# Altium schematic sheet Multiband XOver filter.SchDoc
size A4; SheetNumber: 6; SheetTotal: 7
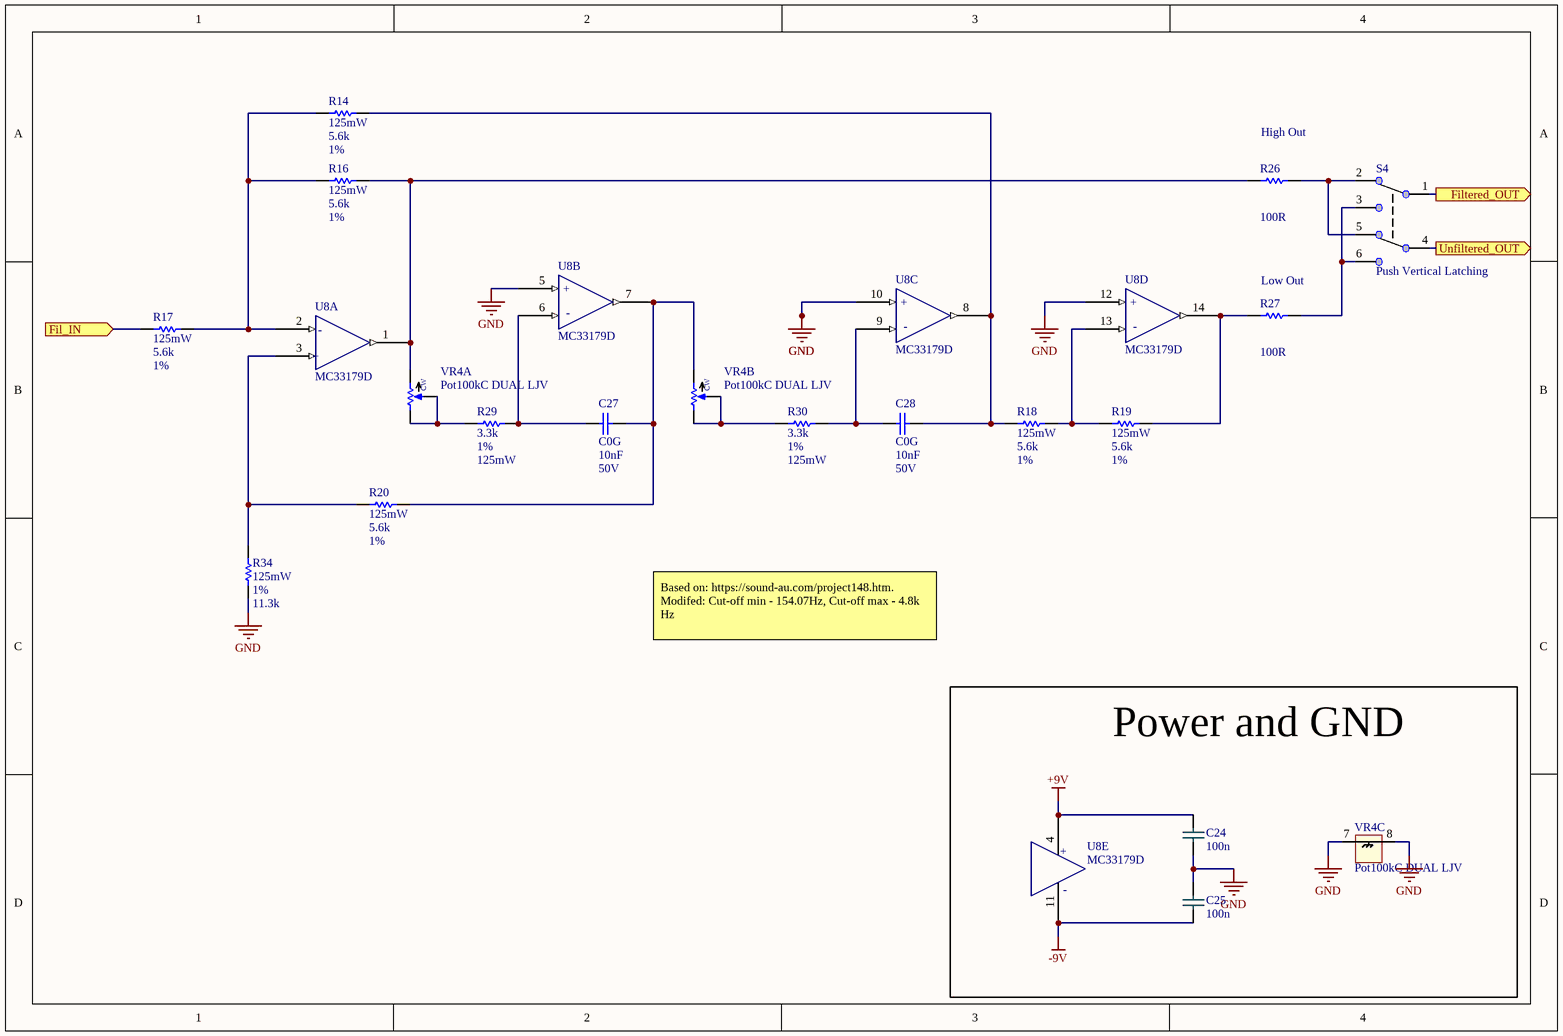
[diagram p0: Multiband XOver filter.SchDoc]

## Parts
C24  value 100n  [0805-CAP]  (hidden comment: Cap 0805 100nF 4)
C25  value 100n  [0805-CAP]  (hidden comment: Cap 0805 100nF 4)
C27  Dielectric: C0G  Capacitance: 10nF  Rated Voltage: 50V  [0805-CAP]  (hidden comment: Cap 10nF 0805 C0G)
C28  Dielectric: C0G  Capacitance: 10nF  Rated Voltage: 50V  [0805-CAP]  (hidden comment: Cap 10nF 0805 C0G)
R14  Power: 125mW  Resistance: 5.6k  Tolerance (+-): 1%  [0805-RES]  (hidden comment: Res 5.6k 1% 0805)
R16  Power: 125mW  Resistance: 5.6k  Tolerance (+-): 1%  [0805-RES]  (hidden comment: Res 5.6k 1% 0805)
R17  Power: 125mW  Resistance: 5.6k  Tolerance (+-): 1%  [0805-RES]  (hidden comment: Res 5.6k 1% 0805)
R18  Power: 125mW  Resistance: 5.6k  Tolerance (+-): 1%  [0805-RES]  (hidden comment: Res 5.6k 1% 0805)
R19  Power: 125mW  Resistance: 5.6k  Tolerance (+-): 1%  [0805-RES]  (hidden comment: Res 5.6k 1% 0805)
R20  Power: 125mW  Resistance: 5.6k  Tolerance (+-): 1%  [0805-RES]  (hidden comment: Res 5.6k 1% 0805)
R26  Resistance: 100R  [0805-RES]  (hidden comment: Res 0805 100R 1%)
R27  Resistance: 100R  [0805-RES]  (hidden comment: Res 0805 100R 1%)
R29  Resistance: 3.3k  Tolerance (+-): 1%  Power: 125mW  [0805-RES]  (hidden comment: Res 3.3k 1% 0805)
R30  Resistance: 3.3k  Tolerance (+-): 1%  Power: 125mW  [0805-RES]  (hidden comment: Res 3.3k 1% 0805)
R34  Power: 125mW  Tolerance (+-): 1%  Resistance: 11.3k  [0805-RES]  (hidden comment: Res 11.3k 1% 0805)
S4  Push Vertical Latching  [PUSH VERTICAL DPDT]
U8  MC33179D  [SOIC14-127P600X175-14N]  (parts A,B,C,D,E of 5)
VR4  Pot100kC DUAL LJV  [LJV 9MM DUAL]  (parts A,B,C of 3)

## Blocks framed on the sheet
Power and GND: C24 C25 U8 VR4

## Ports
Fil_IN (in), Filtered_OUT (out), Unfiltered_OUT (out)

## Nets
+9V: C24.2 U8.4
-9V: C25.1 U8.11
GND: C24.1 C25.2 R34.2 U8.5 U8.10 U8.12 VR4.7 VR4.8
Fil_IN: R17.1 ; port Fil_IN
Filtered_OUT: S4.1 ; port Filtered_OUT
Unfiltered_OUT: S4.4 ; port Unfiltered_OUT
NetC27_1: C27.1 R29.2 U8.6
NetC27_2: C27.2 R20.2 U8.7 VR4.6(CWPIN)
NetC28_1: C28.1 R30.2 U8.9
NetC28_2: C28.2 R14.2 R18.1 U8.8
NetR14_1: R14.1 R16.1 R17.2 U8.2
NetR16_2: R16.2 R26.2 U8.1 VR4.3(CWPIN)
NetR18_2: R18.2 R19.1 U8.13
NetR19_2: R19.2 R27.2 U8.14
NetR20_1: R20.1 R34.1 U8.3
NetR26_1: R26.1 S4.2 S4.5
NetR27_1: R27.1 S4.3 S4.6
NetR29_1: R29.1 VR4.1(CCWPIN) VR4.2(WIPER)
NetR30_1: R30.1 VR4.4(CCWPIN) VR4.5(WIPER)

## Notes on the sheet
- (near R26) High Out
- (near R27) Low Out
- Based on: https://sound-au.com/project148.htm. Modifed: Cut-off min - 154.07Hz, Cut-off max - 4.8k Hz
- (in symbol CMP-028-0019-6, part A) -; +
- (in symbol CMP-028-0019-6, part B) +; -
- (in symbol CMP-028-0019-6, part C) +; -
- (in symbol CMP-028-0019-6, part D) +; -
- (in symbol CMP-028-0019-6, part E) +; -
- (in symbol CMP-028-0097-4, part A) CW
- (in symbol CMP-028-0097-4, part B) CW

## Library data of the parts
C24 C25 = CMP-019-0144-11: 0.1uF 25volts C0G 5%; Source: main.SchLib; PackageDescription: Chip Capacitor; LatestRevisionNote: IPC-7351 Footprint Added.; LatestRevisionDate: 29-May-2009; Publisher: Altium Limited; Published: 8-Jun-2000; Mouser part: 81-GRM31C5C1E104JA01; Design Item ID: Cap 0805 100nF 4; PackageReference: C1206; Fitted: Fitted
C27 C28 = CMP-04096-2: Cap 10nF 0805 C0G 50V +-5%; Tolerance (+-): 5%; Maximum operating temperature: 125°C; Height: 950µm; Size (Imperial): 0805
R14 R16-R20 = CMP-02557-2: Resistor 5.6k +-1% 0805 Thin film 0.125W +-50ppm/°C; Maximum working voltage: 150V; Temperature Coefficient (ppm/°C): 50; Composition: Thin film; Size (Imperial): 0805
R26 R27 = CMP-037-0118-8: 100ohm, 125mW, 1%, thin film; Temperature Coefficient: 50ppm/°C; Voltage Rating (DC): 150V; Composition: Thin Film; Case/Package: 0805; Case Code (Imperial): 0805; Case Code (Metric): 2012; ComponentLink1Description: https://datasheet.ciiva.com/2560/pyu-rt-1-to-0-05-rohs-l-5-2560883.pdf?src-supplier=Digi-Key; ComponentLink1URL: https://datasheet.ciiva.com/2560/pyu-rt-1-to-0-05-rohs-l-5-2560883.pdf?src-supplier=Digi-Key; ComponentLink2Description: https://datasheet.ciiva.com/5624/pyu-rt-1-to-0-05-rohs-l-4-5624374.pdf?src-supplier=Mouser; ComponentLink2URL: https://datasheet.ciiva.com/5624/pyu-rt-1-to-0-05-rohs-l-4-5624374.pdf?src-supplier=Mouser; ComponentLink3Description: https://datasheet.ciiva.com/7942/442970-7942070.pdf?src-supplier=Element14; ComponentLink3URL: https://datasheet.ciiva.com/7942/442970-7942070.pdf?src-supplier=Element14; ComponentLink4Description: https://datasheet.ciiva.com/5925/442970-5925320.pdf?src-supplier=Farnell; ComponentLink4URL: https://datasheet.ciiva.com/5925/442970-5925320.pdf?src-supplier=Farnell; Contact Plating: Tin; Depth: 1.25mm; Design Item ID: Res 0805 100R 1%; Features: Moisture Resistant; Height: 0.024inch; LatestRevisionDate: 17-Jul-2002; LatestRevisionNote: Re-released for DXP Platform.; Lead Free: Lead Free; Length: 2mm; Max Operating Temperature: 125°C; Max Power Dissipation: 125mW; Military Standard: Not; Min Operating Temperature: -55°C; Number of Pins: 2; Number of Terminations: 2; PackageDescription: Axial Device, Thru-Hole; 2 Leads; 0.5 in Pin Spacing; Package Quantity: 5000; PackageReference: AXIAL-0.5; Packaging: Tape and Reel; Power Rating: 125mW; Pricing 1: 1 = 0,10000, 10 = 0,09300, 100 = 0,03580, 1000 = 0,01573, 2500 = 0,01358 (USD); Published: 8-Jun-2000; Publisher: Altium Limited; Radiation Hardening: No; REACH SVHC: No SVHC; RoHS: Yes; Source: main.SchLib; Stock 1: 52567; Termination: SMD/SMT; Tolerance: 1%; Value: 100R; Voltage Rating: 150V; Weight: 0.000194oz; Width: 0.049inch
R29 R30 = CMP-02529-2: Resistor 3.3k +-1% 0805 Thin film 0.125W +-50ppm/°C; Maximum working voltage: 150V; Temperature Coefficient (ppm/°C): 50; Composition: Thin film; Size (Imperial): 0805
R34 = CMP-02591-2: Resistor 11.3k +-1% 0805 Thin film 0.125W +-50ppm/°C; Maximum working voltage: 150V; Temperature Coefficient (ppm/°C): 50; Size (Imperial): 0805; Composition: Thin film
S4 = CMP-028-0063-7: DPDT Pushbutton Latching; Manufacturer Part Number: TL2201EEXA; Darkglass part: D00-0005; Manufacturer: E-Switch; Electrical Life: 10000Cycles; Voltage Rating (DC): 30V; Supplied by Darkglass: YES; Actuator Length: 3mm; Operating Force: 2.16N; Current Rating: 100mA; Switch Function: On-On; ComponentLink2URL: https://datasheet.ciiva.com/16156/p010350f-16156301.pdf?src-supplier=Onlinecomponents.com; Termination: PC Pin; Design Item ID: Push Vertical; Source: main.SchLib; Max Voltage Rating (DC): 30V; RoHS: Yes; Orientation: Straight; Stock 1: 351; ComponentLink1URL: https://datasheet.ciiva.com/2879/p010350g-2879559.pdf?src-supplier=Digi-Key; Throw Configuration: DPDT; Lead Free: Lead Free; ComponentLink1Description: https://datasheet.ciiva.com/2879/p010350g-2879559.pdf?src-supplier=Digi-Key; Package Quantity: 700; ComponentLink2Description: https://datasheet.ciiva.com/16156/p010350f-16156301.pdf?src-supplier=Onlinecomponents.com; Contact Material: Silver; Selective Soldering: YES; Packaging: Bulk; Mount: Through Hole; Pricing 1: 1=0,70000, 10=0,66300, 25=0,63400, 50=0,60400, 100=0,58900, 250=0,57400, 500=0,54500, 1000=0,51500, 2500=0,49200, 10000=0,49200 (USD)
U8 = CMP-028-0019-6: Operational Amplifiers - Op Amps 2-18V Quad Low Power Industrial Temp SOIC14; Manufacturer Part Number: MC33179DR2G; Manufacturer: ON Semiconductor; Max Dual Supply Voltage: 18V; Bandwidth: 5MHz; Common Mode Rejection Ratio: 80dB; Min Dual Supply Voltage: 2V; Number of Amplifiers: 4; Slew Rate: 2V/µs; Input Bias Current: 500nA; Voltage Gain: 106.02dB; Operating Supply Current: 1.7mA; Output Current: 80mA; Input Offset Voltage (Vos): 3mV; Output Current per Channel: 100mA; ComponentLink2Description: https://datasheet.ciiva.com/5787/89824-5787686.pdf?src-supplier=Farnell; ComponentLink12URL: http://datasheet.octopart.com/MC33179DR2G-ON-Semiconductor-datasheet-82522822.pdf?src-supplier=Newark; Min Operating Temperature: -40°C; Pricing 1: 1 = 0.97000, 10 = 0.86300, 100 = 0.67300, 500 = 0.55598, 1000 = 0.43893 (USD); Case/Package: SOIC; Stock 1: 2859; Width: 4mm; Lead Free: Lead Free; ComponentLink11URL: http://datasheet.octopart.com/MC33179DR2G-ON-Semiconductor-datasheet-14137761.pdf?src-supplier=IIIC; ComponentLink3Description: https://datasheet.ciiva.com/26056/mc33178-d-26056822.pdf?src-supplier=Avnet+Europe; ComponentLink4URL: https://datasheet.ciiva.com/1796/mc33178-d-1796957.pdf?src-supplier=Digi-Key; Length: 8.75mm; Mouser part: 863-MC33179DR2G; REACH SVHC: No SVHC; ComponentLink11Description: http://datasheet.octopart.com/MC33179DR2G-ON-Semiconductor-datasheet-14137761.pdf?src-supplier=IIIC; Max Operating Temperature: 85°C; ComponentLink8URL: https://datasheet.ciiva.com/8078/89824-8078570.pdf?src-supplier=Element14; ComponentLink6URL: https://datasheet.ciiva.com/2973/mc33178-d-2973668.pdf?src-supplier=Avnet; ComponentLink3URL: https://datasheet.ciiva.com/26056/mc33178-d-26056822.pdf?src-supplier=Avnet+Europe; Gain Bandwidth Product: 5MHz; Nominal Gain Bandwidth Product: 5MHz; ComponentLink1Description: https://datasheet.ciiva.com/30481/0900766b81276f1b-30481445.pdf?src-supplier=RSComponents; Number of Channels: 4; ComponentLink8Description: https://datasheet.ciiva.com/8078/89824-8078570.pdf?src-supplier=Element14; ComponentLink7Description: https://datasheet.ciiva.com/16212/mc33178-d-16212327.pdf?src-supplier=Future+Electronics; ComponentLink12Description: http://datasheet.octopart.com/MC33179DR2G-ON-Semiconductor-datasheet-82522822.pdf?src-supplier=Newark; ComponentLink7URL: https://datasheet.ciiva.com/16212/mc33178-d-16212327.pdf?src-supplier=Future+Electronics; ComponentLink5URL: https://datasheet.ciiva.com/1796/mc33178-d-1796959.pdf?src-supplier=Digi-Key; ComponentLink1URL: https://datasheet.ciiva.com/30481/0900766b81276f1b-30481445.pdf?src-supplier=RSComponents; ComponentLink5Description: https://datasheet.ciiva.com/1796/mc33178-d-1796959.pdf?src-supplier=Digi-Key; Power Supply Rejection Ratio (PSRR): 80dB; Number of Pins: 14; Unity Gain Bandwidth Product: 5MHz; ComponentLink6Description: https://datasheet.ciiva.com/2973/mc33178-d-2973668.pdf?src-supplier=Avnet; Radiation Hardening: No; Contact Plating: Tin; Package Quantity: 2500; Number of Elements: 4; Nominal Supply Current: 1.7mA; Source: main.SchLib; Packaging: Tape and Reel; Design Item ID: MC33179D; Number of Circuits: 4; ComponentLink4Description: https://datasheet.ciiva.com/1796/mc33178-d-1796957.pdf?src-supplier=Digi-Key; Max Supply Voltage: 18V; ComponentLink9URL: https://datasheet.ciiva.com/1796/mc33178-d-1796958.pdf?src-supplier=Digi-Key; ComponentLink10Description: http://datasheet.octopart.com/MC33179DR2G-ON-Semiconductor-datasheet-164248.pdf?src-supplier=Newark; Height: 1.5mm; Halogen Free: Halogen Free; ComponentLink2URL: https://datasheet.ciiva.com/5787/89824-5787686.pdf?src-supplier=Farnell; ComponentLink10URL: http://datasheet.octopart.com/MC33179DR2G-ON-Semiconductor-datasheet-164248.pdf?src-supplier=Newark; ComponentLink9Description: https://datasheet.ciiva.com/1796/mc33178-d-1796958.pdf?src-supplier=Digi-Key
VR4 = CMP-028-0097-4: Dual gang rev log pot; Supplied by Darkglass: YES; Value: 100kC; SET POSITION: 1; Source: main.SchLib; Design Item ID: Pot100kC DUAL LJV; Selective Soldering: YES